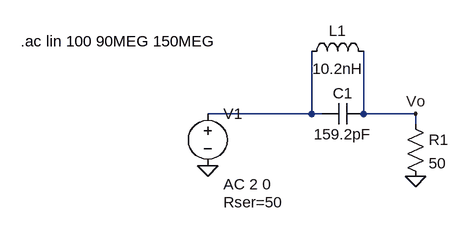
[diagram p0: schematic Draft1.asc]
Draft1.asc, the LTspice schematic file:
Version 4
SHEET 1 880 680
WIRE 496 128 496 32
WIRE 496 128 336 128
WIRE 512 128 496 128
WIRE 576 128 576 32
WIRE 656 128 576 128
WIRE 656 144 656 128
FLAG 336 208 0
FLAG 656 224 0
FLAG 656 128 Vo
SYMBOL voltage 336 112 R0
WINDOW 123 24 124 Left 2
WINDOW 39 24 152 Left 2
SYMATTR InstName V1
SYMATTR Value ""
SYMATTR Value2 AC 2 0
SYMATTR SpiceLine Rser=50
SYMBOL res 640 128 R0
SYMATTR InstName R1
SYMATTR Value 50
SYMBOL ind 480 48 R270
WINDOW 0 32 56 VTop 2
WINDOW 3 5 56 VBottom 2
SYMATTR InstName L1
SYMATTR Value 10.2nH
SYMBOL cap 576 112 R90
WINDOW 0 0 32 VBottom 2
WINDOW 3 32 32 VTop 2
SYMATTR InstName C1
SYMATTR Value 159.2pF
TEXT 48 16 Left 2 !.ac lin 100 90MEG 150MEG

The netlist it stands for:
* Draft1.asc
V1 N001 0 AC 2 0 Rser=50
R1 Vo 0 50
L1 N001 Vo 10.2nH
C1 Vo N001 159.2pF
.ac lin 100 90MEG 150MEG
.backanno
.end